# Altium schematic sheet Ports.SchDoc
size A4
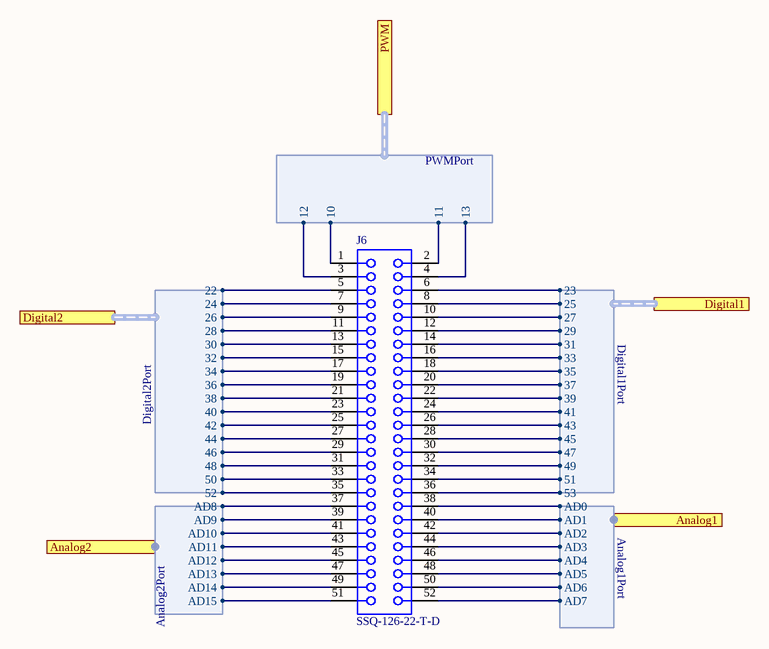
[diagram p0: Ports.SchDoc]

## Parts
J6  SSQ-126-22-T-D  [SMTC-SSQ-126-22-X-D]

## Ports
Analog1 (harness Analog1Port), Analog2 (harness Analog2Port), Digital1 (harness Digital1Port), Digital2 (harness Digital2Port), PWM (harness PWMPort)

## Harnesses
Digital2Port: 22, 24, 26, 28, 30, 32, 34, 36, 38, 40, 42, 44, 46, 48, 50, 52
Digital1Port: 23, 25, 27, 29, 31, 33, 35, 37, 39, 41, 43, 45, 47, 49, 51, 53
PWMPort: 10, 11, 12, 13
Analog1Port: AD0, AD1, AD2, AD3, AD4, AD5, AD6, AD7
Analog2Port: AD8, AD9, AD10, AD11, AD12, AD13, AD14, AD15

## Nets
NetJ6_1: J6.1 ; port PWM.10
NetJ6_2: J6.2 ; port PWM.11
NetJ6_3: J6.3 ; port PWM.12
NetJ6_4: J6.4 ; port PWM.13
NetJ6_5: J6.5 ; port Digital2.22
NetJ6_6: J6.6 ; port Digital1.23
NetJ6_7: J6.7 ; port Digital2.24
NetJ6_8: J6.8 ; port Digital1.25
NetJ6_9: J6.9 ; port Digital2.26
NetJ6_10: J6.10 ; port Digital1.27
NetJ6_11: J6.11 ; port Digital2.28
NetJ6_12: J6.12 ; port Digital1.29
NetJ6_13: J6.13 ; port Digital2.30
NetJ6_14: J6.14 ; port Digital1.31
NetJ6_15: J6.15 ; port Digital2.32
NetJ6_16: J6.16 ; port Digital1.33
NetJ6_17: J6.17 ; port Digital2.34
NetJ6_18: J6.18 ; port Digital1.35
NetJ6_19: J6.19 ; port Digital2.36
NetJ6_20: J6.20 ; port Digital1.37
NetJ6_21: J6.21 ; port Digital2.38
NetJ6_22: J6.22 ; port Digital1.39
NetJ6_23: J6.23 ; port Digital2.40
NetJ6_24: J6.24 ; port Digital1.41
NetJ6_25: J6.25 ; port Digital2.42
NetJ6_26: J6.26 ; port Digital1.43
NetJ6_27: J6.27 ; port Digital2.44
NetJ6_28: J6.28 ; port Digital1.45
NetJ6_29: J6.29 ; port Digital2.46
NetJ6_30: J6.30 ; port Digital1.47
NetJ6_31: J6.31 ; port Digital2.48
NetJ6_32: J6.32 ; port Digital1.49
NetJ6_33: J6.33 ; port Digital2.50
NetJ6_34: J6.34 ; port Digital1.51
NetJ6_35: J6.35 ; port Digital2.52
NetJ6_36: J6.36 ; port Digital1.53
NetJ6_37: J6.37 ; port Analog2.AD8
NetJ6_38: J6.38 ; port Analog1.AD0
NetJ6_39: J6.39 ; port Analog2.AD9
NetJ6_40: J6.40 ; port Analog1.AD1
NetJ6_41: J6.41 ; port Analog2.AD10
NetJ6_42: J6.42 ; port Analog1.AD2
NetJ6_43: J6.43 ; port Analog2.AD11
NetJ6_44: J6.44 ; port Analog1.AD3
NetJ6_45: J6.45 ; port Analog2.AD12
NetJ6_46: J6.46 ; port Analog1.AD4
NetJ6_47: J6.47 ; port Analog2.AD13
NetJ6_48: J6.48 ; port Analog1.AD5
NetJ6_49: J6.49 ; port Analog2.AD14
NetJ6_50: J6.50 ; port Analog1.AD6
NetJ6_51: J6.51 ; port Analog2.AD15
NetJ6_52: J6.52 ; port Analog1.AD7

## Library data of the parts
J6 = CMP-1023-00318-1: SQ Post Socket, Through-hole, Vertical, -55 to 105 degC, 2.54 mm Pitch, 52-Pin, Female, RoHS; Manufacturer: Samtec; Pitch: 2.54 mm; ComponentLink1Description: Manufacturer URL; PartNumber: SSQ-126-22-T-D; PackageDescription: Assembly, Socket Strip .025[0.64] SQ Tail; ComponentLink3Description: Package Specification; DatasheetVersion: F-214; ComponentLink2Description: Datasheet; PackageReference: SSQ-126-22-X-D; PackageVersion: BD, 6/1987; ComponentLink1URL: http://www.samtec.com; Mounting Technology: Through-hole; Orientation: Vertical; ComponentLink3URL: http://www.samtec.com/documents/webfiles/cpdf/SSQ-1XX-XX-XXX-X-XX-XXX-XX-X-MKT.pdf; Temperature Range: -55 to 105 degC; ComponentLink2URL: http://www.samtec.com/documents/webfiles/pdf/SSQ_TH.PDF; RoHS: True